# EAGLE schematic MotorControllerOpto-BA6229 (EAGLE 7.6.0)
Reversible Motor Driver http://www.datasheetdir.com/BA6229+Motor-Controller-Drivers http://beatsdownloadg5.hatenablog.com/entry/reversible-motor-driver-circuit
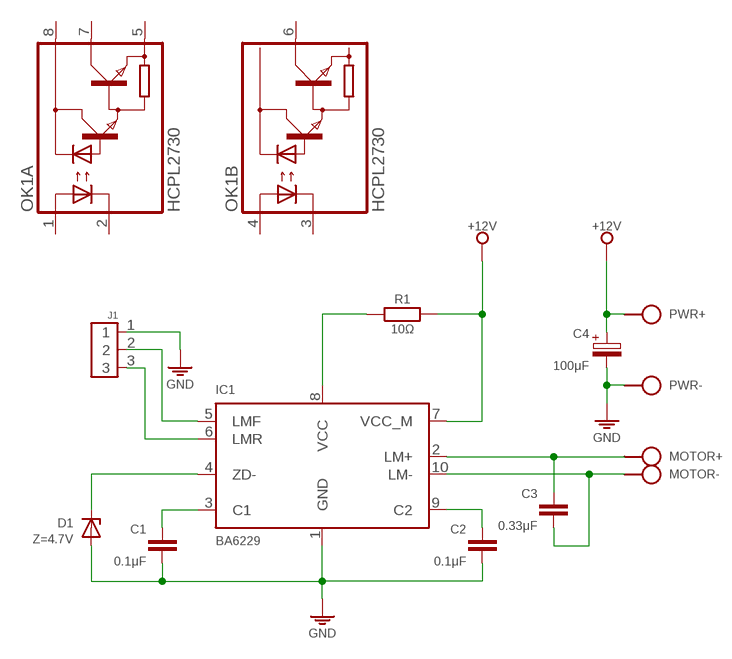
[diagram p0: schematic, sheet 1]

## Parts
C1  0.1μF  C050-020X044  [C050-020X044]
C2  0.1μF  C050-020X044  [C050-020X044]
C3  0.33μF  C050-020X044  [C050-020X044]
C4  100μF  CPOLE2,5-4  [E2,5-4]
D1  Z=4.7V  Z-DIODE34Z5V  [DO34Z5V]
IC1  BA6229  [SIL10]
J1  CONN-3P-3P  [CONN-3P]
MOTOR  SPAD+-  [SPAD+-]
OK1  HCPL2730  [DIL08]
PWR  SPAD+-  [SPAD+-]
R1  10Ω  R-H0204/7-V  [0204/7-V]

## Nets
GND: C1.2 C2.2 C4.- D1.A IC1.1(GND) J1.1 PWR.1
N$1: C3.1 IC1.2(LM+) MOTOR.2
N$2: C2.1 IC1.9(C2)
N$3: C1.1 IC1.3(C1)
N$4: D1.C IC1.4(ZD-)
N$5: IC1.5(LMF) J1.2
N$6: C3.2 IC1.10(LM-) MOTOR.1
N$7: IC1.6(LMR) J1.3
N$8: IC1.8(VCC) R1.1
VCC: C4.+ IC1.7(VCC_M) PWR.2 R1.2 ; supply symbol labelled +12V
Unconnected: OK1.1(A:A1) OK1.2(A:C1) OK1.3(B:C2) OK1.4(B:A2) OK1.5(A:GND) OK1.6(B:VO2) OK1.7(A:VO1) OK1.8(A:VCC)

## Library data of the parts
C1-C3 = c:C: CAPACITOR, European symbol
C4 = c:CPOL: POLARIZED CAPACITOR, European symbol
D1 = d:Z-DIODE
IC1 = ic:BA6229
J1 = pinconn:CONN-3P
MOTOR PWR = pad:SPAD+-
OK1 = optocoupler:HCPL2730: HEWLETT PACKARD OPTO COUPLER; MF: AGILENT TECHNOLOGIES; MPN: HCPL-2730-000E; OC_FARNELL: 9994840; OC_NEWARK: 88H7816
R1 = r:R-H